# EasyEDA Pro project stm32_bracelet.epro

# Schematic Schematic1
Board Name: Board1; Create Date: 2025-02-18; Page Name: P1; Project Name: ARM智能手表; Schematic Name: Schematic1; Update Date: 2025-04-18; Company: 嘉立创EDA; Page Size: A4; Version: V1.0
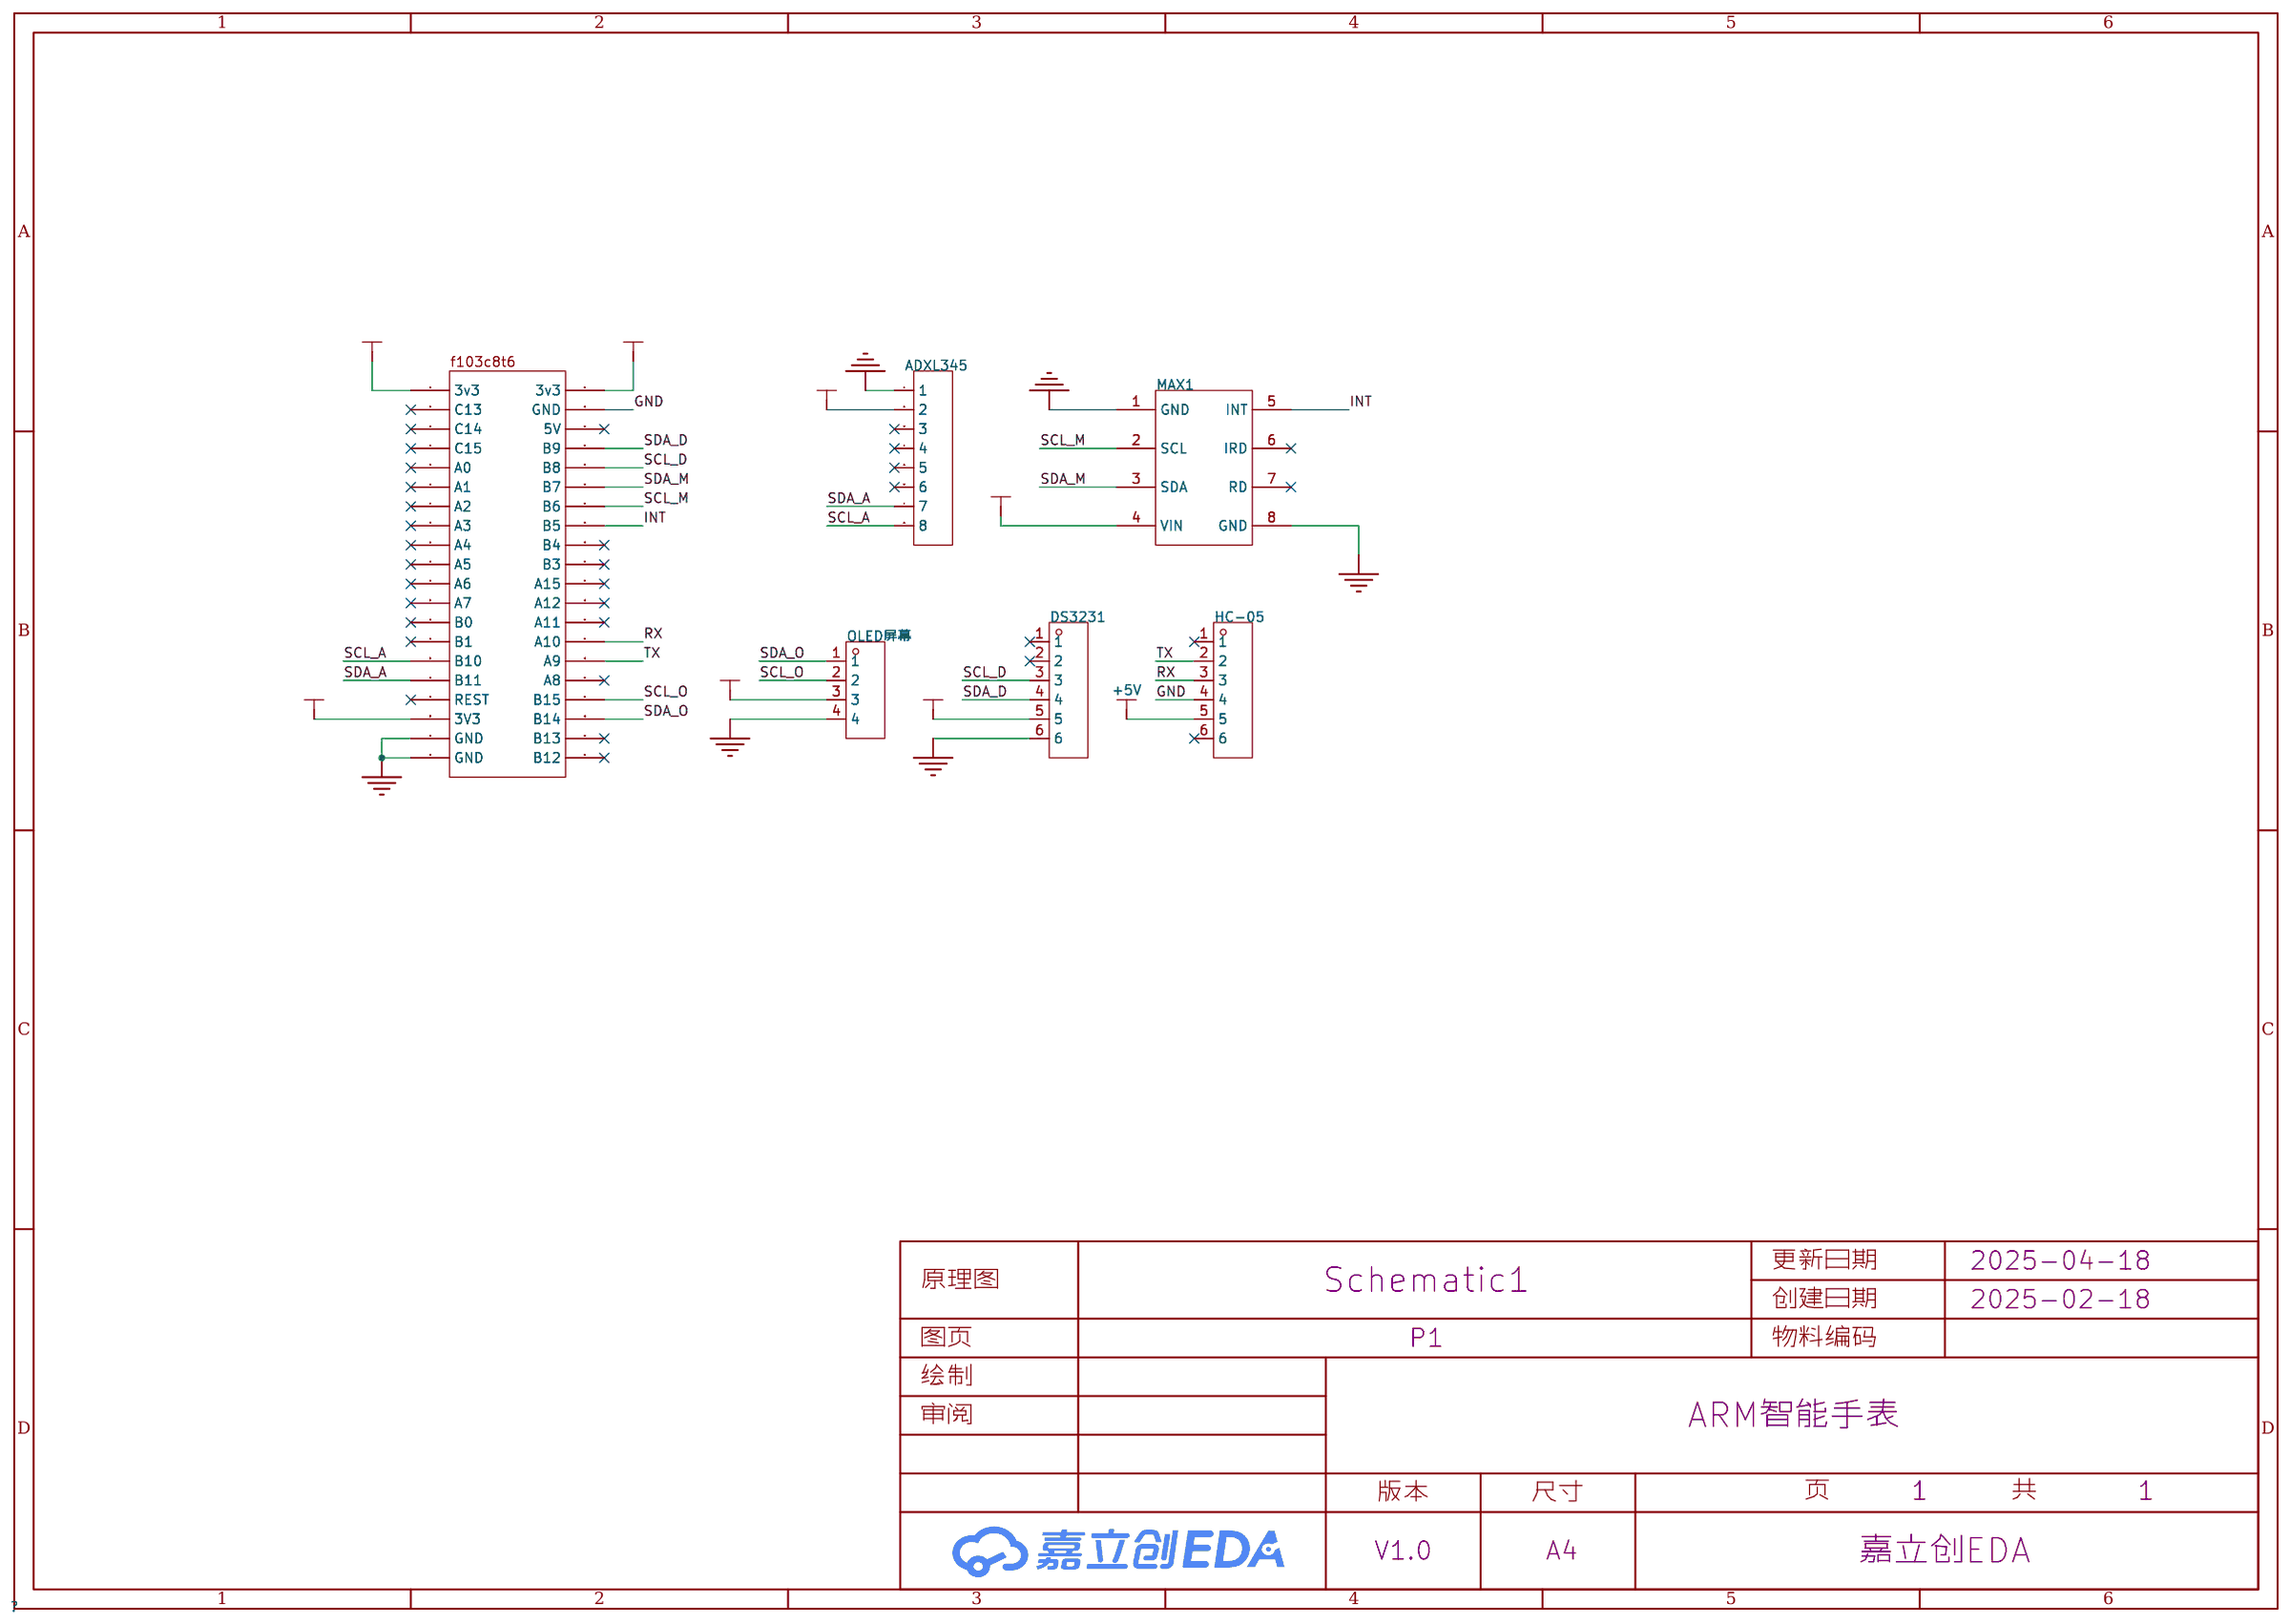
[diagram p0: schematic sheet]

## Parts
ADXL1  ADXL345  [HDR-TH_8P-P2.54-V-F-1]
DS1  DS3231  [HDR-TH_6P-P2.54-V-F]
HC1  HC-05  [HDR-TH_6P-P2.54-V-F]
MAX1  -  [MAX30102]
U1  -  [stm32f103c8t6最小系统板]
U2  OLED屏幕  [HDR-TH_4P-P2.54-V-F]

## Library data of the parts
ADXL1 = HDR-F_2.54_1x8P: Supplier Part: C27438; Supplier Footprint: 插件
DS1 HC1 = HDR-F_2.54_1x6P: Supplier Part: C40877; Supplier Footprint: 插件
MAX1 = MAX30102
U1 = stm32f103c8t6最小系统板
U2 = HDR-F_2.54_1x4P: Supplier Part: C2718488; Supplier Footprint: 插件

## Nets
3V3: ADXL1.2 DS1.5 MAX1.4(VIN) U1.1(3v3) U1.18(3V3) U1.21(3v3) U2.3
+5V: HC1.5
GND: ADXL1.1 DS1.6 HC1.4 MAX1.1(GND) MAX1.8(GND) U1.19(GND) U1.20(GND) U1.22(GND) U2.4
INT: MAX1.5(INT) U1.28(B5)
RX: HC1.3 U1.34(A10)
SCL_A: ADXL1.8 U1.15(B10)
SCL_D: DS1.3 U1.25(B8)
SCL_M: MAX1.2(SCL) U1.27(B6)
SCL_O: U1.37(B15) U2.2
SDA_A: ADXL1.7 U1.16(B11)
SDA_D: DS1.4 U1.24(B9)
SDA_M: MAX1.3(SDA) U1.26(B7)
SDA_O: U1.38(B14) U2.1
TX: HC1.2 U1.35(A9)

Not connected (* = marked no-connect by the designer): ADXL1 3* 4* 5* 6*; DS1 1* 2*; HC1 1* 6*; MAX1 6(IRD)* 7(RD)*; U1 2(C13)* 3(C14)* 4(C15)* 5(A0)* 6(A1)* 7(A2)* 8(A3)* 9(A4)* 10(A5)* 11(A6)* 12(A7)* 13(B0)* 14(B1)* 17(REST)* 23(5V)* 29(B4)* 30(B3)* 31(A15)* 32(A12)* 33(A11)* 36(A8)* 39(B13)* 40(B12)*

# Board PCB1
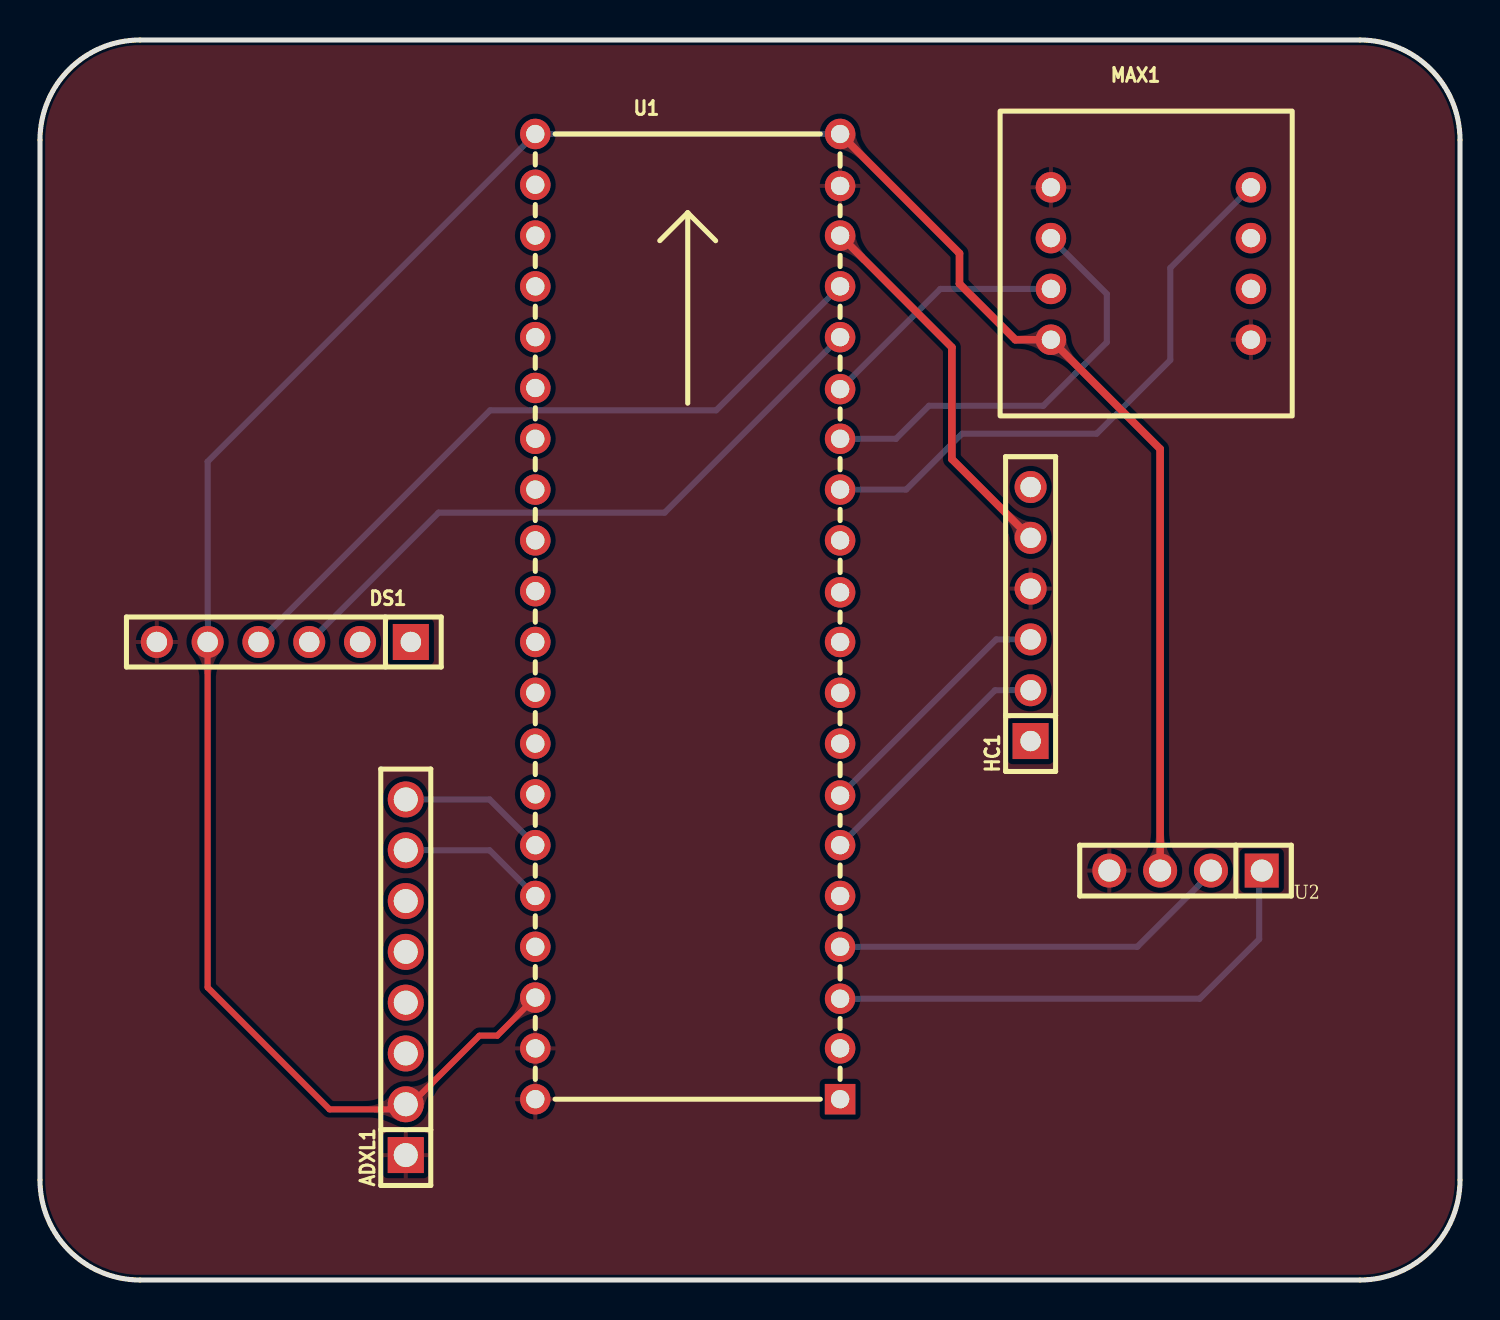
[diagram p1: board, top side]
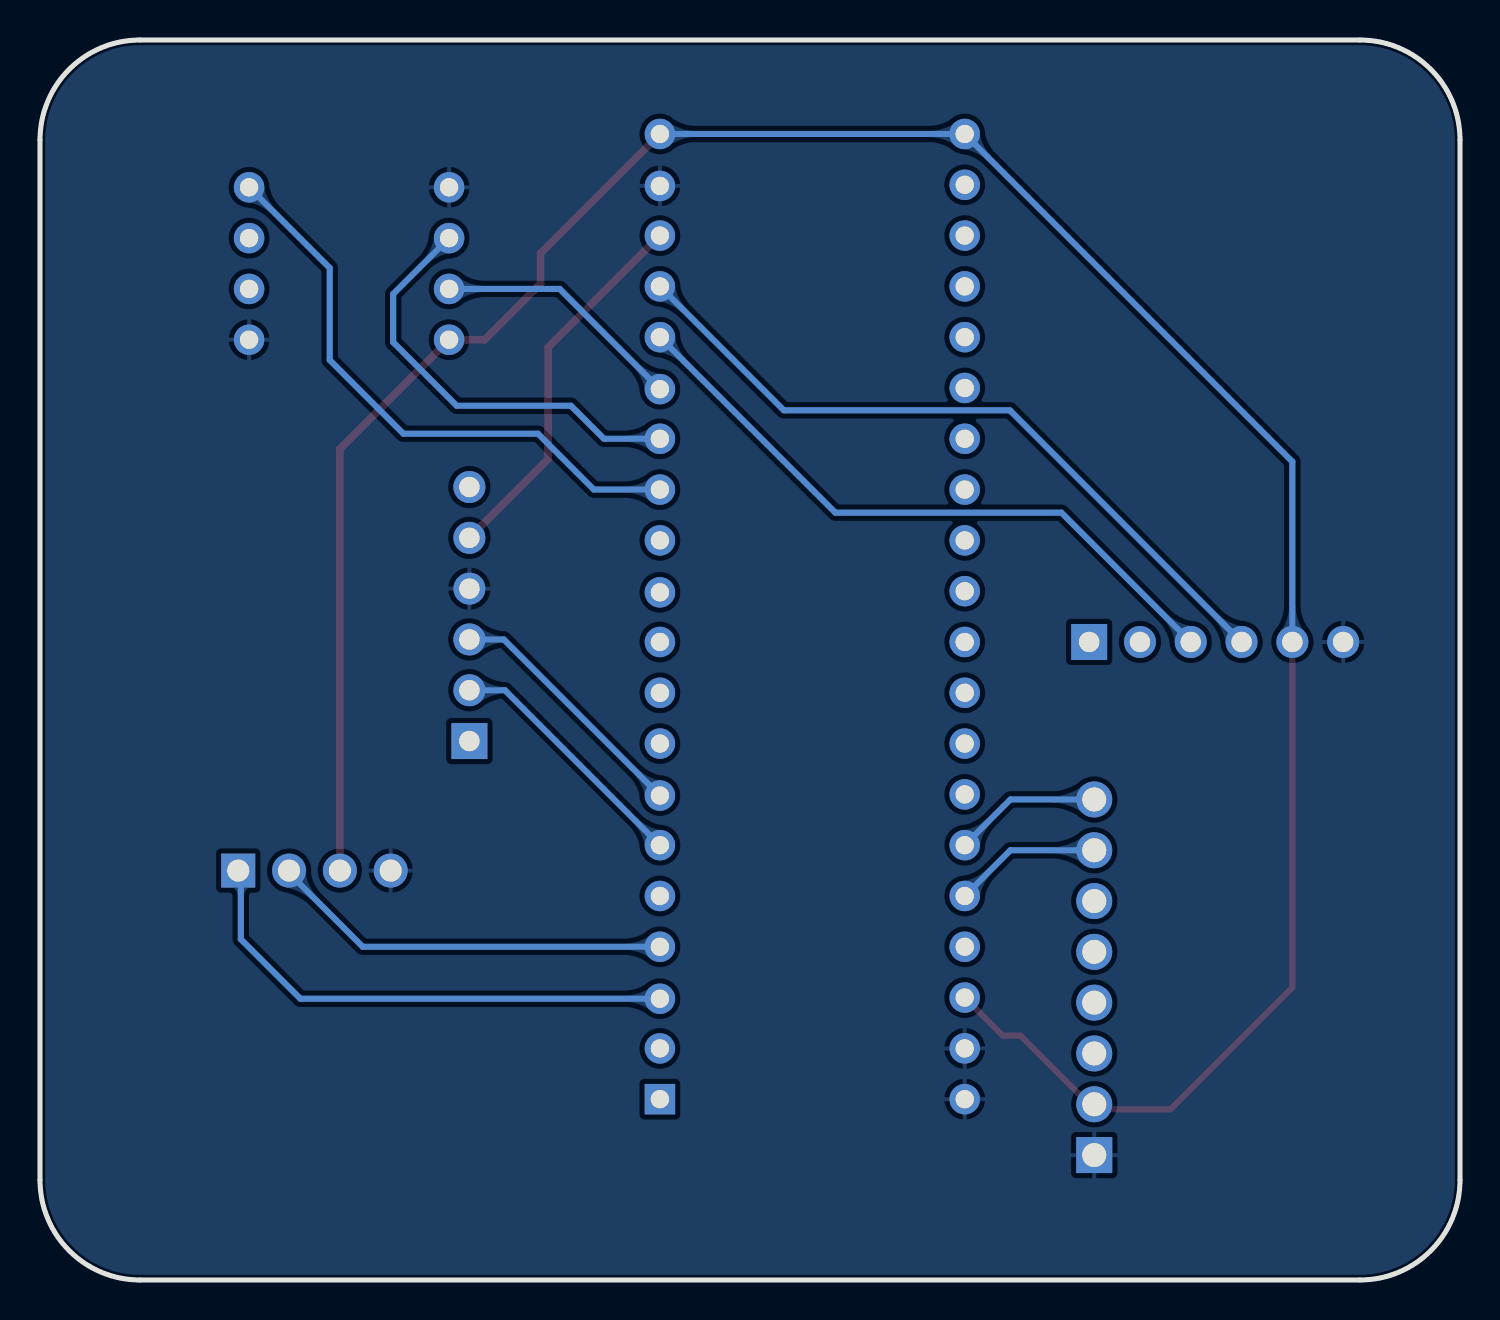
[diagram p2: board, bottom side, seen from below]

Outline 71 x 62 mm; copper layers: Top Layer, Bottom Layer. Coordinates in mm from the lower left corner of the outline.
Outline path: 0,57 0,5 arc(1.46,1.46) 5,0 66,0 arc(69.54,1.46) 71,5 71,57 arc(69.54,60.54) 66,62 5,62 arc(1.46,60.54) 0,57
Stack: Top Layer 0.035mm / Dielectric1 1.51mm FR4 er 4.5 / Bottom Layer 0.035mm

## Design rules (mm)
template: 自定义配置
spacing copperThickness1oz (default): track to track 0.102, other pairs 0.152 to 0.3
spacing copperThickness2oz: track to track 0.203, other pairs 0.152 to 0.3
track width copperThickness1oz (default): min 0.127, default 0.305, max 2.54
track width copperThickness2oz: min 0.203, default 0.254, max 2.54
differential pair differentialPair (default): width min 0.127, default 0.254, max 2.54; gap min 0.152, default 0.152
via viaSize (default): diameter min 0.5, default 0.61, max 10; hole min 0.3, default 0.305, max 6.3

## Placement (name value [footprint] x y rotation side)
ADXL1  ADXL345  [HDR-TH_8P-P2.54-V-F-1]  18.29 15.14 90 top
DS1  DS3231  [HDR-TH_6P-P2.54-V-F]  12.19 31.9 180 top
HC1  HC-05  [HDR-TH_6P-P2.54-V-F]  49.53 33.3 90 top
MAX1  -  [MAX30102]  48.01 58.44 0 top
U1  -  [stm32f103c8t6最小系统板]  24.64 57.17 0 top
U2  OLED屏幕  [HDR-TH_4P-P2.54-V-F]  57.28 20.47 180 top

## Footprints (pads in the part's own frame, mm; a bottom-side part is the same pattern mirrored in y, then rotated)
HDR-TH_4P-P2.54-V-F
  rect 1.7x1.7 hole 1.1: 1(-3.81,0)
  round 1.7 hole 1.1: 2(-1.27,0) 3(1.27,0) 4(3.81,0)
HDR-TH_6P-P2.54-V-F
  rect 1.8x1.8 hole 1.02: 1(-6.35,0)
  round 1.6 hole 1.02: 2(-3.81,0) 3(-1.27,0) 4(1.27,0) 5(3.81,0) 6(6.35,0)
HDR-TH_8P-P2.54-V-F-1
  rect 1.8x1.8 hole 1.2: 1(-8.89,0)
  round 1.8 hole 1.2: 2(-6.35,0) 3(-3.81,0) 4(-1.27,0) 5(1.27,0) 6(3.81,0) 7(6.35,0) 8(8.89,0)
MAX30102
  round 1.524 hole 0.914: 1(2.54,-3.81) 2(2.54,-6.35) 3(2.54,-8.89) 4(2.54,-11.43) 5(12.54,-3.81) 6(12.54,-6.35) 7(12.54,-8.89) 8(12.54,-11.43)
stm32f103c8t6最小系统板
  round 1.524 hole 0.914: 1(0.127,0.127) 2(0.127,-2.413) 3(0.127,-4.953) 4(0.127,-7.493) 5(0.127,-10.033) 6(0.127,-12.573) 7(0.127,-15.113) 8(0.127,-17.653) 9(0.127,-20.193) 10(0.127,-22.733) 11(0.127,-25.273) 12(0.127,-27.813) 13(0.127,-30.353) 14(0.127,-32.893) 15(0.127,-35.433) 16(0.127,-37.973) 17(0.127,-40.513) 18(0.127,-43.053) 19(0.127,-45.593) 20(0.127,-48.133) 21(15.367,0.127) 22(15.367,-2.471) 23(15.367,-4.953) 24(15.367,-7.493) 25(15.367,-10.033) 26(15.367,-12.631) 27(15.367,-15.113) 28(15.367,-17.653) 29(15.367,-20.193) 30(15.367,-22.791) 31(15.367,-25.273) 32(15.367,-27.813) 33(15.367,-30.353) 34(15.367,-32.951) 35(15.367,-35.433) 36(15.367,-37.973) 37(15.367,-40.513) 38(15.367,-43.111) 39(15.367,-45.593)
  rect 1.524x1.524 hole 0.914: 40(15.367,-48.133)

## Nets
As in the schematic, except:
+5V: HC1.5 U1.23

Pads without a net: ADXL1 3 4 5 6; DS1 1 2; HC1 1 6; MAX1 6 7; U1 2 3 4 5 6 7 8 9 10 11 12 13 14 17 29 30 31 32 33 36 39 40

## Routing (per net, layer and track width the routed paths; a pad name or vN(x,y) marks a point on that pad's centre or on a via; arc(x,y) is an arc through that point)
3V3: length 130.4
  Top Layer w0.305: DS1.5 8.38,14.63 14.48,8.53 18.03,8.53 ADXL1.2 18.54,8.79 21.97,12.22 22.86,12.22 24.76,14.12
  Top Layer w0.381: U1.21 45.97,51.33 45.97,49.81 48.77,47.01 MAX1.4 56.01,41.55 56.01,20.47
  Bottom Layer w0.305: DS1.5 8.38,40.92 24.76,57.3 U1.21
+5V: length 19.1
  Top Layer w0.381: HC1.5 45.59,41.05 45.59,46.63 U1.23
INT: length 29.5
  Bottom Layer w0.305: 40,39.52 43.31,39.52 46.1,42.31 52.83,42.31 56.51,46 56.51,50.6 MAX1.5
RX: length 12.8
  Bottom Layer w0.305: U1.34 47.81,32.03 HC1.3
SCL_A: length 7.4
  Bottom Layer w0.305: 24.76,21.74 22.48,24.03 ADXL1.8
SCL_D: length 32.9
  Bottom Layer w0.305: U1.25 31.23,38.37 19.93,38.37 DS1.3
SCL_M: length 21.7
  Bottom Layer w0.305: U1.27 42.8,42.06 44.45,43.71 50.16,43.71 53.34,46.89 53.34,49.3 MAX1.2
SCL_O: length 19.9
  Bottom Layer w0.305: 58.42,20.22 54.86,16.66 U1.37
SDA_A: length 7.4
  Bottom Layer w0.305: 24.76,19.2 22.48,21.49 ADXL1.7
SDA_D: length 36.4
  Bottom Layer w0.305: DS1.4 22.5,43.48 33.81,43.48 40,49.68
SDA_M: length 12.6
  Bottom Layer w0.305: U1.26 45.02,49.55 MAX1.3
SDA_O: length 25.4
  Bottom Layer w0.305: U1.38 57.98,14.06 60.96,17.04 60.96,20.22
TX: length 12.7
  Bottom Layer w0.305: HC1.2 47.75,29.49 40,21.74

## Copper pours and planes (outline as drawn; the poured copper is in the pictures)
GND on Top Layer: -4.7,64.79 77.22,64.79 77.22,-3.91 -4.7,-3.91
GND on Bottom Layer: -9.02,65.56 83.19,65.56 83.19,-1.75 -9.02,-1.75

Small or netless copper shapes (teardrops, artwork), in the pictures only: 10 on Top Layer, 26 on Bottom Layer
